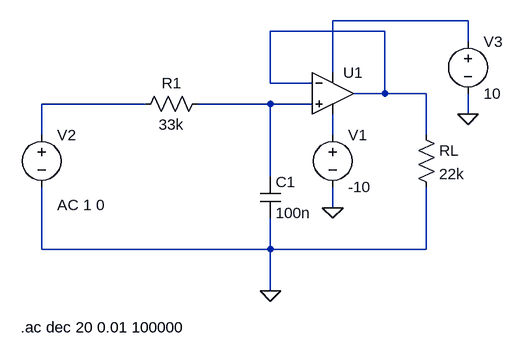
[diagram p0: schematic circuito_iii_pratica_4.asc]
circuito_iii_pratica_4.asc, the LTspice schematic file:
Version 4
SHEET 1 920 680
WIRE 736 -96 528 -96
WIRE 608 -80 432 -80
WIRE 736 -64 736 -96
WIRE 528 -16 528 -96
WIRE 432 0 432 -80
WIRE 496 0 432 0
WIRE 608 16 608 -80
WIRE 608 16 560 16
WIRE 672 16 608 16
WIRE 240 32 80 32
WIRE 432 32 320 32
WIRE 496 32 432 32
WIRE 736 48 736 16
WIRE 80 80 80 32
WIRE 528 80 528 48
WIRE 672 80 672 16
WIRE 432 144 432 32
WIRE 528 192 528 160
WIRE 80 256 80 160
WIRE 432 256 432 208
WIRE 432 256 80 256
WIRE 672 256 672 160
WIRE 672 256 432 256
WIRE 432 320 432 256
FLAG 432 320 0
FLAG 528 192 0
FLAG 736 48 0
SYMBOL res 336 16 R90
WINDOW 0 0 56 VBottom 2
WINDOW 3 32 56 VTop 2
SYMATTR InstName R1
SYMATTR Value 33k
SYMBOL voltage 80 64 R0
WINDOW 123 24 124 Left 2
WINDOW 39 0 0 Left 0
SYMATTR Value2 AC 1 0
SYMATTR InstName V2
SYMATTR Value ""
SYMBOL cap 416 144 R0
SYMATTR InstName C1
SYMATTR Value 100n
SYMBOL res 656 64 R0
SYMATTR InstName RL
SYMATTR Value 22k
SYMBOL voltage 528 64 R0
SYMATTR InstName V1
SYMATTR Value -10
SYMBOL voltage 736 -80 R0
SYMATTR InstName V3
SYMATTR Value 10
SYMBOL OpAmps\\UniversalOpAmp 528 16 R0
SYMATTR InstName U1
TEXT 48 376 Left 2 !.ac dec 20 0.01 100000

The netlist it stands for:
* circuito_iii_pratica_4.asc
R1 N004 N003 33k
V2 N003 0 AC 1 0
C1 N004 0 100n
RL N002 0 22k
V1 N005 0 -10
V3 N001 0 10
XU1 N004 N002 N001 N005 N002 level1 Avol=1Meg GBW=10Meg Vos=0 En=0 Enk=0 In=0 Ink=0 Rin=500Meg  ; pins In+ In- V+ V- OUT
.ac dec 20 0.01 100000
.lib UniversalOpAmp1.lib
.backanno
.end